# Altium project Omnifly-H7.PrjPcb (part 2 of 2)

## Sheet Pyro-Other.SchDoc: Pyro / Buzzer / CAN
size A4; SheetNumber: 6; SheetTotal: 6
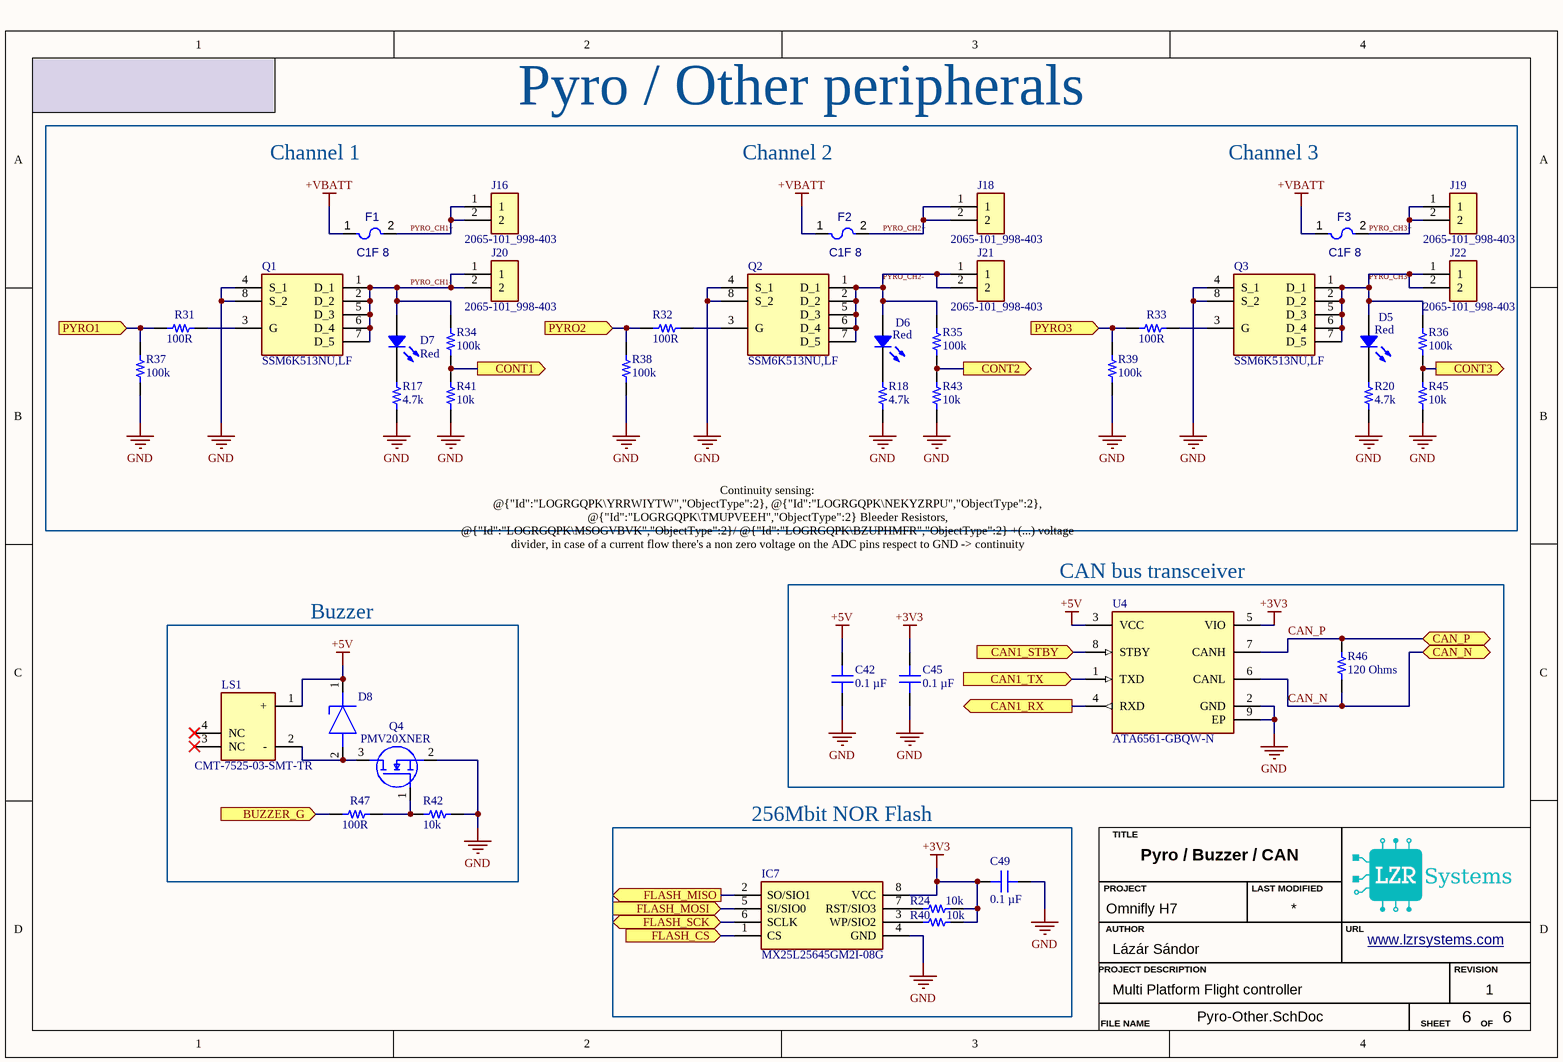
[diagram p4: Pyro-Other.SchDoc]

### Parts
C42  0.1 µF  [MURATA GCM155 0402_1005]
C45  0.1 µF  [MURATA GCM155 0402_1005]
C49  0.1 µF  [MURATA GCM155 0402_1005]
D5  Red  [LED 0402_1005 RED]
D6  Red  [LED 0402_1005 RED]
D7  Red  [LED 0402_1005 RED]
D8  PESD24VS1UA  [SOD2512X110N]  (value not drawn)
F1  C1F 8  [FP-3216FF-IPC_A]
F2  C1F 8  [FP-3216FF-IPC_A]
F3  C1F 8  [FP-3216FF-IPC_A]
IC7  MX25L25645GM2I-08G  [SOIC127P790X216-8N]
J16  2065-101_998-403  [2065101998403]
J18  2065-101_998-403  [2065101998403]
J19  2065-101_998-403  [2065101998403]
J20  2065-101_998-403  [2065101998403]
J21  2065-101_998-403  [2065101998403]
J22  2065-101_998-403  [2065101998403]
LS1  CMT-7525-03-SMT-TR  [CMT752503SMTTR]
Q1  SSM6K513NU,LF  [SSM6K513NULF]
Q2  SSM6K513NU,LF  [SSM6K513NULF]
Q3  SSM6K513NU,LF  [SSM6K513NULF]
Q4  PMV20XNER  [SOT95P230X110-3N]
R17  4.7k  [YAGEO RES 0402_1005]
R18  4.7k  [YAGEO RES 0402_1005]
R20  4.7k  [YAGEO RES 0402_1005]
R24  10k  [YAGEO RES 0402_1005]
R31  100R  [RES 0402_1005]
R32  100R  [RES 0402_1005]
R33  100R  [RES 0402_1005]
R34  100k  [YAGEO RES 0402_1005]
R35  100k  [YAGEO RES 0402_1005]
R36  100k  [YAGEO RES 0402_1005]
R37  100k  [YAGEO RES 0402_1005]
R38  100k  [YAGEO RES 0402_1005]
R39  100k  [YAGEO RES 0402_1005]
R40  10k  [YAGEO RES 0402_1005]
R41  10k  [YAGEO RES 0402_1005]
R42  10k  [YAGEO RES 0402_1005]
R43  10k  [YAGEO RES 0402_1005]
R45  10k  [YAGEO RES 0402_1005]
R46  120 Ohms  [KOA RES RK73 RN73 0603_1608]
R47  100R  [RES 0402_1005]
U4  ATA6561-GBQW-N  [FP-C04-21358-IPC_B]

### Blocks framed on the sheet
CAN bus transceiver: C42 C45 R46 U4
Buzzer: D8 LS1 Q4 R42 R47
256Mbit NOR Flash: C49 IC7 R24 R40

### Ports
BUZZER_G (in), CAN1_RX (out), CAN1_STBY (in), CAN1_TX (in), CAN_N (bidir), CAN_P (bidir), CONT1 (out), CONT2 (out), CONT3 (out), FLASH_CS (in), FLASH_MISO (out), FLASH_MOSI (in), FLASH_SCK (bidir), PYRO1 (in), PYRO2 (in), PYRO3 (in)

### Nets
+3V3: C45.1 C49.1 IC7.8(VCC) R24.1 R40.1 U4.5(VIO)
+5V: C42.1 D8.1(K) LS1.1(+) U4.3(VCC)
+VBATT: F1.1 F2.1 F3.1
GND: C42.2 C45.2 C49.2 IC7.4(GND) Q1.4(S_1) Q1.8(S_2) Q2.4(S_1) Q2.8(S_2) Q3.4(S_1) Q3.8(S_2) Q4.2(S) R17.1 R18.1 R20.1 R37.1 R38.1 R39.1 R41.1 R42.1 R43.1 R45.1 U4.2(GND) U4.9(EP)
AUX_MISO: IC7.2(SO/SIO1) ; port FLASH_MISO
AUX_MOSI: IC7.5(SI/SIO0) ; port FLASH_MOSI
AUX_SCK: IC7.6(SCLK) ; port FLASH_SCK
BUZZER: R47.1 ; port BUZZER_G
CAN_N: R46.1 U4.6(CANL) ; port CAN_N
CAN_P: R46.2 U4.7(CANH) ; port CAN_P
FLASH_CS: IC7.1(CS) ; port FLASH_CS
PYRO_CH1: R31.1 R37.2 ; port PYRO1
PYRO_CH1+: F1.2 J16.1 J16.2
PYRO_CH1-: D7.1 J20.1 J20.2 Q1.1(D_1) Q1.2(D_2) Q1.5(D_3) Q1.6(D_4) Q1.7(D_5) R34.2
PYRO_CH1_CONT: R34.1 R41.2 ; port CONT1
PYRO_CH2: R32.1 R38.2 ; port PYRO2
PYRO_CH2+: F2.2 J18.1 J18.2
PYRO_CH2-: D6.1 J21.1 J21.2 Q2.1(D_1) Q2.2(D_2) Q2.5(D_3) Q2.6(D_4) Q2.7(D_5) R35.2
PYRO_CH2_CONT: R35.1 R43.2 ; port CONT2
PYRO_CH3: R33.1 R39.2 ; port PYRO3
PYRO_CH3+: F3.2 J19.1 J19.2
PYRO_CH3-: D5.1 J22.1 J22.2 Q3.1(D_1) Q3.2(D_2) Q3.5(D_3) Q3.6(D_4) Q3.7(D_5) R36.2
PYRO_CH3_CONT: R36.1 R45.2 ; port CONT3
NetD5_2: D5.2 R20.2
NetD6_2: D6.2 R18.2
NetD7_2: D7.2 R17.2
NetD8_2: D8.2(A) LS1.2(-) Q4.3(D)
NetIC7_3: IC7.3(WP/SIO2) R40.2
NetIC7_7: IC7.7(RST/SIO3) R24.2
NetQ1_3: Q1.3(G) R31.2
NetQ2_3: Q2.3(G) R32.2
NetQ3_3: Q3.3(G) R33.2
NetQ4_1: Q4.1(G) R42.2 R47.2
NetU3_1: U4.8(STBY) ; port CAN1_STBY
NetU3_95: U4.4(RXD) ; port CAN1_RX
NetU3_96: U4.1(TXD) ; port CAN1_TX

Not connected (* = marked no-connect by the designer): LS1 3(NC)* 4(NC)*

### Notes on the sheet
- Pyro / Other peripherals
- Channel 1
- Channel 2
- Channel 3
- Continuity sensing:
  @{"Id":"LOGRGQPK\YRRWIYTW","ObjectType":2}, @{"Id":"LOGRGQPK\NEKYZRPU","ObjectType":2}, @{"Id":"LOGRGQPK\TMUPVEEH","ObjectType":2} Bleeder Resistors, @{"Id":"LOGRGQPK\MSOGVBVK","ObjectType":2}/ @{"Id":"LOGRGQPK\BZUPHMFR","ObjectType":2} +(...) voltage divider, in case of a current flow there's a non zero voltage on the ADC pins respect to GND -> continuity
- TITLE
- AUTHOR
- PROJECT
- LAST MODIFIED
- URL
- PROJECT DESCRIPTION
- REVISION
- FILE NAME
- SHEET
- OF

### Library data of the parts
C42 C45 C49 = GCM155R71H104ME02D: CAP CER 0.1UF 50V X7R 0402; manufacturer: Murata Electronics; Tolerance: ±20%; Part Number: GCM155R71H104ME02D; Capacitance: 0.1 µF; Applications: Automotive; componentlink1description: Datasheet; componentlink1url: https://psearch.en.murata.com/capacitor/product/GCM155R71H104ME02%23.pdf; componentlink2description: DigiKey Link; componentlink2url: https://www.digikey.com/en/products/detail/murata-electronics/GCM155R71H104ME02D/9867913; Device Package: 0402 (1005 Metric); lastupdated: 7/20/2024 2:04:19 AM; Lifecycle Status: Active; Minimum Order: 1; Mounting Type: Surface Mount, MLCC; Operating Temperature: -55°C ~ 125°C; Package / Case: 0402 (1005 Metric); packaging: TapeAndReel; partid: 39038; Part Status: Active; price: 0.01; Ratings: AEC-Q200; series: GCM; Size / Dimension: 0.039" L x 0.020" W (1.00mm x 0.50mm); Supplier 1: DigiKey; Supplier Part Number 1: 490-18204-1-ND; Temperature Coefficient: X7R; Thickness (Max): 0.022" (0.55mm); value: 0.1 µF; Voltage - Rated: 50V
D5-D7 = SM0402RC: LED RED CLEAR 0402 SMD; Manufacturer: Bivar Inc.; Configuration: 0402; Current - Test: 20mA; Lens Color: Colorless; Lens Size: 0.50mm x 1.00mm; Lens Style: Rectangle with Flat Top; Millicandela Rating: 90mcd; Viewing Angle: 130°; Voltage - Forward (Vf) (Typ): 2.1V; Wavelength - Dominant: 631nm; Wavelength - Peak: 645nm; Part Number: SM0402RC; Color: Red; ComponentLink1Description: Datasheet; ComponentLink1URL: https://www.bivar.com/Files/Datasheets/SM0402RC.pdf; ComponentLink2Description: DigiKey Link; ComponentLink2URL: https://www.digikey.com/en/products/detail/bivar-inc/SM0402RC/6810864; Device Package: 0402 (1005 Metric); Height (Max): 0.71mm; LastUpdated: 6/3/2024 7:59:17 PM; Lens Transparency: Clear; Lifecycle Status: Active; Minimum Order: 1; Mounting Type: Surface Mount; Package / Case: 0402 (1005 Metric); Packaging: TapeAndReel; PartId: 509; Part Status: Active; Price: 0.16; Series: -; Size / Dimension: 1.00mm L x 0.50mm W; Supplier 1: DigiKey; Supplier Part Number 1: 492-2208-1-ND; Supplier Device Package: 0402; Value: Red
D8 = PESD24VS1UA,115: Diode ESD (Uni-directional); Manufacturer_Name: Nexperia; Datasheet Link: https://assets.nexperia.com/documents/data-sheet/PESD24VS1UA.pdf; Height: 1.1mm; Manufacturer_Part_Number: PESD24VS1UA,115; Mouser Part Number: 771-PESD24VS1UA115; Mouser Price/Stock: https://www.mouser.co.uk/ProductDetail/Nexperia/PESD24VS1UA115?qs=A1cBxND5mHKZ%252BhkKKiwSEA%3D%3D; Arrow Part Number: PESD24VS1UA,115; Arrow Price/Stock: https://www.arrow.com/en/products/pesd24vs1ua115/nexperia
F1-F3 = CMP-005-00014-1: Fuse Chip Fast Acting 10A 24V SMD Solder Pad 1206 T/R CSA/UL/cULus; Case/Package: 1206; Current Rating: 10A; Pins: 2; Max Operating Temperature: 125°C; Min Operating Temperature: -55°C; Mounting Technology: Surface Mount
IC7 = MX25L25645GM2I-08G: Integrated Circuit; Manufacturer_Name: Macronix; Datasheet Link: https://www.farnell.com/datasheets/2815324.pdf; Height: 2.16mm; Manufacturer_Part_Number: MX25L25645GM2I-08G; Mouser Part Number: N/A; Mouser Price/Stock: https://www.mouser.co.uk/ProductDetail/Macronix/MX25L25645GM2I-08G?qs=Z%252BL2brAPG1Ifpgm4Amotqg%3D%3D; Arrow Part Number: MX25L25645GM2I-08G; Arrow Price/Stock: https://www.arrow.com/en/products/mx25l25645gm2i-08g/macronix-international?utm_currency=USD&region=nac
J16 J18-J22 = 2065-101_998-403: Connector; Manufacturer_Name: Wago; Manufacturer_Part_Number: 2065-101/998-403; Datasheet Link: https://www.farnell.com/datasheets/2849884.pdf?_gl=1*d6n7fb*_gcl_au*MTg5NzcyMzM3OS4xNzU0MjQ4OTUy; Height: 2.7mm
LS1 = CMT-7525-03-SMT-TR: Loudspeaker or Buzzer; Manufacturer_Name: Same Sky; Description: CMT-7525-03-SMT-TR - 7.5 mm; Datasheet Link: https://www.sameskydevices.com/product/resource/CMT-7525-03-SMT-TR.pdf; Height: 2.7mm; Manufacturer_Part_Number: CMT-7525-03-SMT-TR; Mouser Part Number: 179-CMT-7525-03SMTTR; Mouser Price/Stock: https://www.mouser.co.uk/ProductDetail/Same-Sky/CMT-7525-03-SMT-TR?qs=olJun0bQHM86ULzT6E8ouQ%3D%3D
Q1-Q3 = SSM6K513NU,LF: MOSFET (N-Channel); Manufacturer_Name: Toshiba; Datasheet Link: https://toshiba.semicon-storage.com/info/docget.jsp?did=53148&prodName=SSM6K513NU; Height: 0.8mm; Manufacturer_Part_Number: SSM6K513NU,LF; Mouser Part Number: 757-SSM6K513NULF; Mouser Price/Stock: https://www.mouser.co.uk/ProductDetail/Toshiba/SSM6K513NULF?qs=zPgndZZmKGbOGaIT7oO3Dw%3D%3D; Arrow Part Number: SSM6K513NU,LF; Arrow Price/Stock: https://www.arrow.com/en/products/ssm6k513nulf/toshiba?region=nac
Q4 = PMV20XNER: MOSFET (N-Channel); Manufacturer_Name: Nexperia; Datasheet Link: https://assets.nexperia.com/documents/data-sheet/PMV20XNE.pdf; Height: 1.1mm; Manufacturer_Part_Number: PMV20XNER; Mouser Part Number: 771-PMV20XNER; Mouser Price/Stock: https://www.mouser.co.uk/ProductDetail/Nexperia/PMV20XNER?qs=%252BRKXB2WKlSevPnXiP0DAaQ%3D%3D; Arrow Part Number: PMV20XNER; Arrow Price/Stock: https://www.arrow.com/en/products/pmv20xner/nexperia?utm_currency=USD&region=nac
R17 R18 R20 = AC0402FR-7W4K7L: RES 4.7K OHM 1% 1/8W 0402; Manufacturer: Yageo; Power (Watts): 0.125W, 1/8W; Resistance: 4.7 kOhms; Temperature Coefficient: ±100ppm/°C; Part Number: AC0402FR-7W4K7L; Value: 4.7k; ComponentLink1Description: Datasheet; ComponentLink1URL: https://www.yageo.com/upload/media/product/productsearch/datasheet/rchip/PYu-AC_51_RoHS_L_10.pdf; ComponentLink2Description: DigiKey Link; ComponentLink2URL: https://www.digikey.com/en/products/detail/yageo/AC0402FR-7W4K7L/17009027; Composition: Thick Film; Device Package: 0402 (1005 Metric); Features: Automotive AEC-Q200, Moisture Resistant; Height - Seated (Max): 0.015" (0.37mm); LastUpdated: 8/31/2025 3:03:39 PM; Lifecycle Status: Active; Minimum Order: 1; Number of Terminations: 2; Operating Temperature: -55°C ~ 155°C; Package / Case: 0402 (1005 Metric); Packaging: CutTape; PartId: 78681; Price: 0.01; Ratings: AEC-Q200; Series: AC; Size / Dimension: 0.039" L x 0.020" W (1.00mm x 0.50mm); Supplier 1: DigiKey; Supplier Part Number 1: 13-AC0402FR-7W4K7LCT-ND; Supplier Device Package: 0402; Tolerance: ±1%
R24 R40-R43 R45 = AC0402FR-1310KL: RES 10K OHM 1% 1/16W 0402; Manufacturer: Yageo; Power (Watts): 0.063W, 1/16W; Resistance: 10 kOhms; Temperature Coefficient: ±100ppm/°C; Part Number: AC0402FR-1310KL; Value: 10k; ComponentLink1Description: Datasheet; ComponentLink1URL: https://www.yageo.com/upload/media/product/productsearch/datasheet/rchip/PYu-AC_51_RoHS_L_8.pdf; ComponentLink2Description: DigiKey Link; ComponentLink2URL: https://www.digikey.com/en/products/detail/yageo/AC0402FR-1310KL/12756397; Composition: Thick Film; Device Package: 0402 (1005 Metric); Features: Automotive AEC-Q200, Moisture Resistant; Height - Seated (Max): 0.015" (0.37mm); LastUpdated: 8/31/2025 3:03:46 PM; Lifecycle Status: Active; Minimum Order: 1; Number of Terminations: 2; Operating Temperature: -55°C ~ 155°C; Package / Case: 0402 (1005 Metric); Packaging: CutTape; PartId: 69220; Part Status: Active; Price: 0.01; Ratings: AEC-Q200; Series: AC; Size / Dimension: 0.039" L x 0.020" W (1.00mm x 0.50mm); Supplier 1: DigiKey; Supplier Part Number 1: 13-AC0402FR-1310KLCT-ND; Supplier Device Package: 0402; Tolerance: ±1%
R31-R33 R47 = 504L1000FTNCFT: RES SMD 100 OHM 1% 1/8W 0402; Manufacturer: American Technical Ceramics; Power (Watts): 0.125W, 1/8W; Resistance: 100 Ohms; Temperature Coefficient: -50/ -150ppm/°C; Part Number: 504L1000FTNCFT; Value: 100R; ComponentLink1Description: Datasheet; ComponentLink1URL: http://www.atceramics.com/UserFiles/504L_ubr_resistor.pdf; ComponentLink2Description: DigiKey Link; ComponentLink2URL: http://digikey.com/product-detail/en/american-technical-ceramics/504L1000FTNCFT/1284-1327-1-ND/4789907; Composition: Thin Film; Device Package: 0402 (1005 Metric); Features: RF, High Frequency; Height - Seated (Max): 0.024" (0.60mm); LastUpdated: 2/9/2024 8:30:03 PM; Lifecycle Status: Active; Minimum Order: 1; Number of Terminations: 2; Operating Temperature: -40°C ~ 125°C; Package / Case: 0402 (1005 Metric); Packaging: TapeAndReel; PartId: 7485; Part Status: Active; Price: 1.53; Series: ATC504; Size / Dimension: 0.039" L x 0.020" W (1.00mm x 0.50mm); Supplier 1: DigiKey; Supplier Part Number 1: 1284-1327-1-ND; Supplier Device Package: 0402; Tolerance: ±1%
R34-R39 = AC0402FR-13100KL: RES 100K OHM 1% 1/16W 0402; Manufacturer: Yageo; Power (Watts): 0.063W, 1/16W; Resistance: 100 kOhms; Temperature Coefficient: ±100ppm/°C; Part Number: AC0402FR-13100KL; Value: 100k; ComponentLink1Description: Datasheet; ComponentLink1URL: https://www.yageo.com/upload/media/product/productsearch/datasheet/rchip/PYu-AC_51_RoHS_L_8.pdf; ComponentLink2Description: DigiKey Link; ComponentLink2URL: https://www.digikey.com/en/products/detail/yageo/AC0402FR-13100KL/14008459; Composition: Thick Film; Device Package: 0402 (1005 Metric); Features: Automotive AEC-Q200; Height - Seated (Max): 0.015" (0.37mm); LastUpdated: 8/31/2025 3:03:52 PM; Lifecycle Status: Active; Minimum Order: 1; Number of Terminations: 2; Operating Temperature: -55°C ~ 155°C; Package / Case: 0402 (1005 Metric); Packaging: CutTape; PartId: 65177; Part Status: Active; Price: 0.01; Ratings: AEC-Q200; Series: AC; Size / Dimension: 0.039" L x 0.020" W (1.00mm x 0.50mm); Supplier 1: DigiKey; Supplier Part Number 1: 13-AC0402FR-13100KLCT-ND; Supplier Device Package: 0402; Tolerance: ±1%
R46 = RK73H1JTTD1200F: RES 120 OHM 1% 1/8W 0603; Manufacturer: KOA Speer Electronics, Inc.; Power (Watts): 0.125W, 1/8W; Temperature Coefficient: ±100ppm/°C; Part Number: RK73H1JTTD1200F; Value: 120 Ohms; ComponentLink1Description: Datasheet; ComponentLink1URL: http://www.koaspeer.com/catimages/Products/RK73H/RK73H.pdf; ComponentLink2Description: DigiKey Link; ComponentLink2URL: https://www.digikey.com/en/products/detail/koa-speer-electronics-inc/RK73H1JTTD1200F/9844960; Composition: Thick Film; Device Package: 0603 (1608 Metric); Features: Automotive AEC-Q200; Height - Seated (Max): 0.022" (0.55mm); LastUpdated: 7/25/2024 9:43:06 AM; Lifecycle Status: Active; Minimum Order: 1; Number of Terminations: 2; Operating Temperature: -55°C ~ 155°C; Package / Case: 0603 (1608 Metric); Packaging: CutTape; PartId: 15761; Part Status: Active; Price: 0.01; Ratings: AEC-Q200; Resistance: 120 Ohms; Series: RK73H; Size / Dimension: 0.063" L x 0.031" W (1.60mm x 0.80mm); Supplier 1: DigiKey; Supplier Part Number 1: 2019-RK73H1JTTD1200FCT-ND; Supplier Device Package: 0603; Tolerance: ±1%
U4 = CMP-015-00008-1: Industrial Grade Can Trx With Vio Pin (Dfn8) Rohs Compliant: Yes; Min Supply Voltage: 4.5V; Max Supply Voltage: 5.5V; Min Operating Temperature: -40°C; Pins: 8; Max Operating Temperature: 150°C

## Sheet Power-scheme.SchDoc: Power Scheme
size A4; Author: Lázár Sándor; SheetNumber: 2; SheetTotal: 6; URL: lzrsystems.com
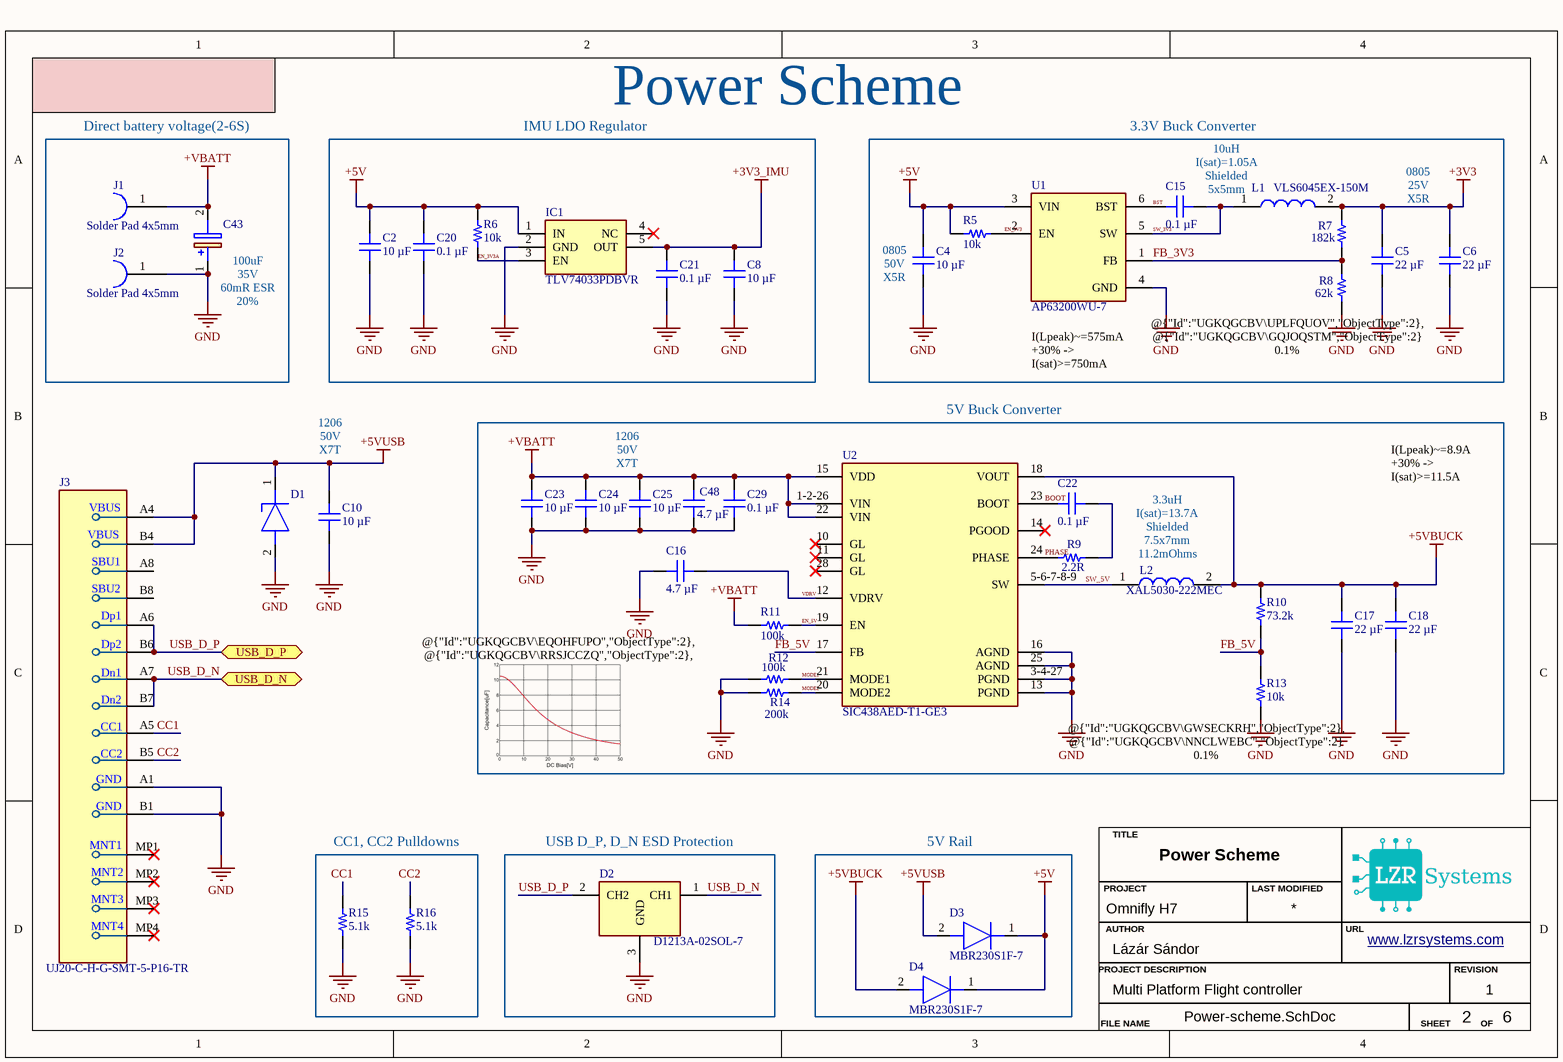
[diagram p5: Power-scheme.SchDoc]

### Parts
C2  10 µF  [MURATA GRM21B 0805_2012]
C4  10 µF  [MURATA GRM21B 0805_2012]
C5  22 µF  [MURATA GRM21B 0805_2012]
C6  22 µF  [MURATA GRM21B 0805_2012]
C8  10 µF  [MURATA GRM21B 0805_2012]
C10  10 µF  [MURATA GRM21B 0805_2012]
C15  0.1 µF  [MURATA GCM155 0402_1005]
C16  4.7 µF  [MURATA GRM21B 0805_2012]
C17  22 µF  [CAP 1206_3216 - 0.8MM]
C18  22 µF  [CAP 1206_3216 - 0.8MM]
C20  0.1 µF  [MURATA GCM155 0402_1005]
C21  0.1 µF  [MURATA GCM155 0402_1005]
C22  0.1 µF  [MURATA GCM155 0402_1005]
C23  10 µF  [CAP 1206_3216 - 0.8MM]
C24  10 µF  [CAP 1206_3216 - 0.8MM]
C25  10 µF  [CAP 1206_3216 - 0.8MM]
C29  0.1 µF  [MURATA GCM155 0402_1005]
C43  T523H107M035APE070  [CAPPM7360X200N]  (value not drawn)
C48  4.7 µF  [MURATA GRM21B 0805_2012]
D1  PESD24VS1UA  [SOD2512X110N]  (value not drawn)
D2  D1213A-02SOL-7  [D1213A02SOL7]
D3  MBR230S1F-7  [SODFL3518X115N]
D4  MBR230S1F-7  [SODFL3518X115N]
IC1  TLV74033PDBVR  [SOT95P280X145-5N]
J1  Solder Pad 4x5mm  [Solder Pad 4x5mm-Footprint-1]
J2  Solder Pad 4x5mm  [Solder Pad 4x5mm-Footprint-1]
J3  UJ20-C-H-G-SMT-5-P16-TR  [UJ20CHGSMT5P16TR]
L1  VLS6045EX-150M  [VLS6045]
L2  XAL5030-222MEC  [XAL5030222MEC]
R5  10k  [YAGEO RES 0402_1005]
R6  10k  [YAGEO RES 0402_1005]
R7  182k  [YAGEO RES 0402_1005]
R8  62k  [YAGEO RES 0402_1005]
R9  2.2R  [YAGEO RES 0402_1005]
R10  73.2k  [YAGEO RES 0402_1005]
R11  100k  [YAGEO RES 0402_1005]
R12  100k  [YAGEO RES 0402_1005]
R13  10k  [YAGEO RES 0402_1005]
R14  200k  [YAGEO RES 0402_1005]
R15  5.1k  [YAGEO RES 0402_1005]
R16  5.1k  [YAGEO RES 0402_1005]
U1  AP63200WU-7  [FP-TSOT26-MFG]
U2  SIC438AED-T1-GE3  [FP-T22-0442-MFG]

### Blocks framed on the sheet
Direct battery voltage(2-6S): C43 J1 J2
IMU LDO Regulator: C2 C8 C20 C21 IC1 R6
3.3V Buck Converter: C4-C6 C15 L1 R5 R7 R8 U1
5V Buck Converter: C16-C18 C22-C25 C29 C48 L2 R9-R14 U2
CC1, CC2 Pulldowns: R15 R16
USB D_P, D_N ESD Protection: D2
5V Rail: D3 D4

### Ports
USB_D_N (bidir), USB_D_P (bidir)

### Nets
+3V3: C5.2 C6.2 L1.2 R7.2
+3V3_IMU: C8.2 C21.2 IC1.5(OUT)
+5V: C2.2 C4.2 C20.2 D3.1(K) D4.1(K) IC1.1(IN) R5.2 R6.2 U1.3(VIN)
+5VBUCK: C17.2 C18.2 D4.2(A) L2.2 R10.2 U2.18(VOUT)
+5VUSB: C10.2 D1.1(K) D3.2(A) J3.A4(VBUS) J3.B4(VBUS_2)
+VBATT: C23.2 C24.2 C25.2 C29.2 C43.2(-) C48.2 J1.1 R11.1 U2.1-2-26(VIN) U2.15(VDD) U2.22(VIN)
GND: C2.1 C4.1 C5.1 C6.1 C8.1 C10.1 C16.1 C17.1 C18.1 C20.1 C21.1 C23.1 C24.1 C25.1 C29.1 C43.1(+) C48.1 D1.2(A) D2.3(GND) IC1.2(GND) J2.1 J3.A1(GND_1) J3.B1(GND_2) R8.2 R12.1 R13.2 R14.1 R15.1 R16.1 U1.4(GND) U2.3-4-27(PGND) U2.13(PGND) U2.16(AGND) U2.25(AGND)
BOOT: C22.2 U2.23(BOOT)
BST: C15.2 U1.6(BST)
CC1: J3.A5(CC1) R15.2
CC2: J3.B5(CC2) R16.2
EN_3V3: R5.1 U1.2(EN)
EN_3V3A: IC1.3(EN) R6.1
EN_5V: R11.2 U2.19(EN)
FB_3V3: R7.1 R8.1 U1.1(FB)
FB_5V: R10.1 R13.1 U2.17(FB)
MODE1: R12.2 U2.21(MODE1)
MODE2: R14.2 U2.20(MODE2)
PHASE: R9.1 U2.24(PHASE)
SW_3V3: C15.1 L1.1 U1.5(SW)
SW_5V: L2.1 U2.5-6-7-8-9(SW)
USB_D_N: D2.1(CH1) J3.A7(DN1) J3.B7(DN2) ; port USB_D_N
USB_D_P: D2.2(CH2) J3.A6(DP1) J3.B6(DP2) ; port USB_D_P
VDRV: C16.2 U2.12(VDRV)
NetC22_1: C22.1 R9.2

Not connected (* = marked no-connect by the designer): IC1 4(NC)*; J3 A8(SBU1) B8(SBU2) MP1* MP2* MP3* MP4*; U2 10(GL)* 11(GL)* 14(PGOOD)* 28(GL)*

### Notes on the sheet
- Power Scheme
- 10uH
  I(sat)=1.05A
  Shielded 5x5mm
- 0805
  25V
  X5R
- (near C43) 100uF
  35V
  60mR ESR
  20%
- (near C4) 0805
  50V
  X5R
- (near U1) I(Lpeak)~=575mA +30% ->
  I(sat)>=750mA
- (near R8) @{"Id":"UGKQGCBV\UPLFQUOV","ObjectType":2}, @{"Id":"UGKQGCBV\GQJOQSTM","ObjectType":2}
  0.1%
  25ppm
- 1206
  50V
  X7T
- I(Lpeak)~=8.9A +30% ->
  I(sat)>=11.5A
- (near L2) 3.3uH
  I(sat)=13.7A
  Shielded 7.5x7mm
  11.2mOhms
- @{"Id":"UGKQGCBV\EQOHFUPO","ObjectType":2}, @{"Id":"UGKQGCBV\RRSJCCZQ","ObjectType":2}, @{"Id":"UGKQGCBV\IXDVLWBT","ObjectType":2}
  DC Bias Characteristics
- (near R13) @{"Id":"UGKQGCBV\GWSECKRH","ObjectType":2}, @{"Id":"UGKQGCBV\NNCLWEBC","ObjectType":2}
  0.1%
  25ppm
- TITLE
- AUTHOR
- PROJECT
- LAST MODIFIED
- URL
- PROJECT DESCRIPTION
- REVISION
- FILE NAME
- SHEET
- OF
- (in symbol UJ20-C-H-G-SMT-5-P16-TR) Dp1; Dp2; Dn1; Dn2; GND; MNT1; MNT2; MNT3; MNT4

### Library data of the parts
C2 C4 C8 C10 = GRM21BR61H106ME43L: CAP CER 10UF 50V X5R 0805; manufacturer: Murata Electronics; Tolerance: ±20%; Part Number: GRM21BR61H106ME43L; Capacitance: 10 µF; Applications: General Purpose; componentlink1description: Datasheet; componentlink1url: https://search.murata.co.jp/Ceramy/image/img/A01X/G101/ENG/GRM21BR61H106ME43-01A.pdf; componentlink2description: DigiKey Link; componentlink2url: https://www.digikey.com/en/products/detail/murata-electronics/GRM21BR61H106ME43L/10326317; Device Package: 0805 (2012 Metric); lastupdated: 8/27/2024 9:29:56 AM; Lifecycle Status: Active; Minimum Order: 1; Mounting Type: Surface Mount, MLCC; Operating Temperature: -55°C ~ 85°C; Package / Case: 0805 (2012 Metric); packaging: TapeAndReel; partid: 41295; Part Status: Active; price: 0.05; series: GRM; Size / Dimension: 0.079" L x 0.049" W (2.00mm x 1.25mm); Supplier 1: DigiKey; Supplier Part Number 1: 490-18664-1-ND; Temperature Coefficient: X5R; Thickness (Max): 0.057" (1.45mm); value: 10 µF; Voltage - Rated: 50V
C5 C6 = GRM21BR61C226ME44L: CAP CER 22UF 16V X5R 0805; manufacturer: Murata Electronics; Tolerance: ±20%; Part Number: GRM21BR61C226ME44L; Capacitance: 22 µF; Applications: General Purpose; componentlink1description: Datasheet; componentlink1url: https://search.murata.co.jp/Ceramy/image/img/A01X/G101/ENG/GRM21BR61C226ME44-01.pdf; componentlink2description: DigiKey Link; componentlink2url: https://www.digikey.com/en/products/detail/murata-electronics/GRM21BR61C226ME44L/4905531; Device Package: 0805 (2012 Metric); lastupdated: 8/27/2024 9:29:55 AM; Lifecycle Status: Active; Minimum Order: 1; Mounting Type: Surface Mount, MLCC; Operating Temperature: -55°C ~ 85°C; Package / Case: 0805 (2012 Metric); packaging: TapeAndReel; partid: 16967; Part Status: Active; price: 0.06; series: GRM; Size / Dimension: 0.079" L x 0.049" W (2.00mm x 1.25mm); Supplier 1: DigiKey; Supplier Part Number 1: 490-10747-1-ND; Temperature Coefficient: X5R; Thickness (Max): 0.057" (1.45mm); value: 22 µF; Voltage - Rated: 16V
C15 C20-C22 C29 = GCM155R71H104ME02D: as C42 on sheet Pyro-Other; Part Number: GCM155R71H104ME02D; Capacitance: 0.1 µF; Applications: Automotive; componentlink1description: Datasheet; componentlink1url: https://psearch.en.murata.com/capacitor/product/GCM155R71H104ME02%23.pdf; componentlink2description: DigiKey Link; componentlink2url: https://www.digikey.com/en/products/detail/murata-electronics/GCM155R71H104ME02D/9867913; Device Package: 0402 (1005 Metric); lastupdated: 7/20/2024 2:04:19 AM; Lifecycle Status: Active; Minimum Order: 1; Mounting Type: Surface Mount, MLCC; Operating Temperature: -55°C ~ 125°C; Package / Case: 0402 (1005 Metric); packaging: TapeAndReel; partid: 39038; Part Status: Active; price: 0.01; Ratings: AEC-Q200; series: GCM; Size / Dimension: 0.039" L x 0.020" W (1.00mm x 0.50mm); Supplier 1: DigiKey; Supplier Part Number 1: 490-18204-1-ND; Temperature Coefficient: X7R; Thickness (Max): 0.022" (0.55mm); value: 0.1 µF; Voltage - Rated: 50V
C16 C48 = GRM21BR61H475KE51L: CAP CER 4.7UF 50V X5R 0805; manufacturer: Murata Electronics; Tolerance: ±10%; Part Number: GRM21BR61H475KE51L; Capacitance: 4.7 µF; Applications: General Purpose; componentlink1description: Datasheet; componentlink1url: https://search.murata.co.jp/Ceramy/image/img/A01X/G101/ENG/GRM21BR61H475KE51-01.pdf; componentlink2description: DigiKey Link; componentlink2url: https://www.digikey.com/en/products/detail/murata-electronics/GRM21BR61H475KE51L/4905540; Device Package: 0805 (2012 Metric); lastupdated: 8/27/2024 9:29:55 AM; Lifecycle Status: Active; Minimum Order: 1; Mounting Type: Surface Mount, MLCC; Operating Temperature: -55°C ~ 85°C; Package / Case: 0805 (2012 Metric); packaging: TapeAndReel; partid: 15077; Part Status: Active; price: 0.03; series: GRM; Size / Dimension: 0.079" L x 0.049" W (2.00mm x 1.25mm); Supplier 1: DigiKey; Supplier Part Number 1: 490-10751-1-ND; Temperature Coefficient: X5R; Thickness (Max): 0.055" (1.40mm); value: 4.7 µF; Voltage - Rated: 50V
C17 C18 = GRT31CC81C226ME01L: CAP CER 22UF 16V X6S 1206; manufacturer: Murata Electronics; Tolerance: ±20%; Part Number: GRT31CC81C226ME01L; Capacitance: 22 µF; Applications: Automotive; componentlink1description: Datasheet; componentlink1url: https://search.murata.co.jp/Ceramy/image/img/A01X/G101/ENG/GRT31CC81C226ME01-01.pdf; componentlink2description: DigiKey Link; componentlink2url: https://www.digikey.com/en/products/detail/murata-electronics/GRT31CC81C226ME01L/5416832; Device Package: 1206 (3216 Metric); lastupdated: 6/4/2024 7:10:39 PM; Lifecycle Status: Active; Minimum Order: 1; Mounting Type: Surface Mount, MLCC; Operating Temperature: -55°C ~ 105°C; Package / Case: 1206 (3216 Metric); packaging: TapeAndReel; partid: 20406; Part Status: Active; price: 0.09; Ratings: AEC-Q200; series: GRT; Size / Dimension: 0.126" L x 0.063" W (3.20mm x 1.60mm); Supplier 1: DigiKey; Supplier Part Number 1: 490-12410-1-ND; Temperature Coefficient: X6S; Thickness (Max): 0.071" (1.80mm); value: 22 µF; Voltage - Rated: 16V
C23-C25 = CGA5L3X5R1H106K160AB: CAP CER 10UF 50V X5R 1206; manufacturer: TDK Corporation; Tolerance: ±10%; Part Number: CGA5L3X5R1H106K160AB; Capacitance: 10 µF; Applications: Automotive; componentlink1description: Datasheet; componentlink1url: https://product.tdk.com/info/en/catalog/datasheets/mlcc_automotive_general_en.pdf?ref_disty=digikey; componentlink2description: DigiKey Link; componentlink2url: https://www.digikey.com/en/products/detail/tdk-corporation/CGA5L3X5R1H106K160AB/2781312; Device Package: 1206 (3216 Metric); lastupdated: 6/4/2024 7:10:33 PM; Lifecycle Status: Active; Minimum Order: 1; Mounting Type: Surface Mount, MLCC; Operating Temperature: -55°C ~ 85°C; Package / Case: 1206 (3216 Metric); packaging: TapeAndReel; partid: 54402; Part Status: Active; price: 0.22; Ratings: AEC-Q200; series: CGA; Size / Dimension: 0.126" L x 0.063" W (3.20mm x 1.60mm); Supplier 1: DigiKey; Supplier Part Number 1: 445-7886-1-ND; Temperature Coefficient: X5R; Thickness (Max): 0.075" (1.90mm); value: 10 µF; Voltage - Rated: 50V
C43 = T523H107M035APE070: Capacitor Polarised; Manufacturer_Name: KEMET; Datasheet Link: https://content.kemet.com/datasheets/KEM_T2079_SSD.pdf; Height: 2mm; Manufacturer_Part_Number: T523H107M035APE070; Mouser Part Number: 80-T523H107M35APE070; Mouser Price/Stock: https://www.mouser.co.uk/ProductDetail/KEMET/T523H107M035APE070?qs=unwgFEO1A6s1KPLWumNkZA%3D%3D; Arrow Part Number: T523H107M035APE070; Arrow Price/Stock: https://www.arrow.com/en/products/t523h107m035ape070/kemet-corporation
D1 = PESD24VS1UA,115: as D8 on sheet Pyro-Other; Datasheet Link: https://assets.nexperia.com/documents/data-sheet/PESD24VS1UA.pdf; Height: 1.1mm; Manufacturer_Part_Number: PESD24VS1UA,115; Mouser Part Number: 771-PESD24VS1UA115; Mouser Price/Stock: https://www.mouser.co.uk/ProductDetail/Nexperia/PESD24VS1UA115?qs=A1cBxND5mHKZ%252BhkKKiwSEA%3D%3D; Arrow Part Number: PESD24VS1UA,115; Arrow Price/Stock: https://www.arrow.com/en/products/pesd24vs1ua115/nexperia
D2 = D1213A-02SOL-7: TVS Diode (Uni-directional); Manufacturer_Name: Diodes Incorporated; Datasheet Link: https://www.diodes.com//assets/Datasheets/D1213A-02SOL.pdf; Height: 1.2mm; Manufacturer_Part_Number: D1213A-02SOL-7; Mouser Part Number: 621-D1213A-02SOL-7; Mouser Price/Stock: https://www.mouser.co.uk/ProductDetail/Diodes-Incorporated/D1213A-02SOL-7?qs=gfe7vQ8txpUT2qMa05IpnA%3D%3D; Arrow Part Number: D1213A-02SOL-7; Arrow Price/Stock: https://www.arrow.com/en/products/d1213a-02sol-7/diodes-incorporated?utm_currency=USD&region=nac
D3 D4 = MBR230S1F-7: Diode; Manufacturer_Name: Diodes Incorporated; Datasheet Link: https://www.diodes.com/assets/Datasheets/MBR230S1F.pdf; Height: 1.15mm; Manufacturer_Part_Number: MBR230S1F-7; Mouser Part Number: 621-MBR230S1F-7; Mouser Price/Stock: https://www.mouser.co.uk/ProductDetail/Diodes-Incorporated/MBR230S1F-7?qs=5V6w%252Be2aIqaf4rGxjeeHeQ%3D%3D; Arrow Part Number: MBR230S1F-7; Arrow Price/Stock: https://www.arrow.com/en/products/mbr230s1f-7/diodes-incorporated?region=nac
IC1 = TLV74033PDBVR: Integrated Circuit; Manufacturer_Name: Texas Instruments; Datasheet Link: https://www.ti.com/lit/ds/symlink/tlv740p.pdf?ts=1599647884466&ref_url=https%253A%252F%252Fwww.ti.com%252Fpower-management%252Flinear-regulators-ldo%252Fproducts.html; Height: 1.45mm; Manufacturer_Part_Number: TLV74033PDBVR; Mouser Part Number: 595-TLV74033PDBVR; Mouser Price/Stock: https://www.mouser.co.uk/ProductDetail/Texas-Instruments/TLV74033PDBVR?qs=sPbYRqrBIVkaG2WMvPh1eg%3D%3D; Arrow Part Number: TLV74033PDBVR; Arrow Price/Stock: https://www.arrow.com/en/products/tlv74033pdbvr/texas-instruments?utm_currency=USD&region=nac
J1 J2 = CMP-002-00080-1: Solerd Pad 4x5mm mainly for Flight Controller Vbatt
J3 = UJ20-C-H-G-SMT-5-P16-TR: Connector; Manufacturer_Name: Same Sky; Datasheet Link: https://www.sameskydevices.com/product/resource/UJ20-C-H-G-SMT-5-P16-TR.pdf; Height: 3.41mm; Manufacturer_Part_Number: UJ20-C-H-G-SMT-5-P16-TR; Mouser Part Number: 179-UJ20CHGSMT5P16TR; Mouser Price/Stock: https://www.mouser.co.uk/ProductDetail/Same-Sky/UJ20-C-H-G-SMT-5-P16-TR?qs=IKkN%2F947nfD2hE8asV9%252BEg%3D%3D; Arrow Part Number: UJ20-C-H-G-SMT-5-P16-TR; Arrow Price/Stock: https://www.arrow.com/en/products/uj20-c-h-g-smt-5-p16-tr/cui-devices?utm_currency=USD&region=nac
L1 = VLS6045EX-150M: Inductor; Manufacturer_Name: TDK; Datasheet Link: https://product.tdk.com/system/files/dam/doc/product/inductor/inductor/smd/catalog/inductor_commercial_power_vls6045ex_en.pdf; Manufacturer_Part_Number: VLS6045EX-150M; Mouser Part Number: 810-VLS6045EX-150M; Mouser Price/Stock: https://www.mouser.co.uk/ProductDetail/TDK/VLS6045EX-150M?qs=oF%2FSscNnLpDh4m%2FVdQ%2FgKQ%3D%3D; Arrow Part Number: VLS6045EX-150M; Arrow Price/Stock: https://www.arrow.com/en/products/vls6045ex-150m/tdk?region=nac
L2 = XAL5030-222MEC: Inductor; Manufacturer_Name: COILCRAFT; Datasheet Link: https://www.coilcraft.com/getmedia/49bc46c8-4b2c-45b9-9b6c-2eaa235ea698/xal50xx.pdf; Height: 3.1mm; Manufacturer_Part_Number: XAL5030-222MEC; Mouser Part Number: 994-XAL5030-222MEC; Mouser Price/Stock: https://www.mouser.co.uk/ProductDetail/Coilcraft/XAL5030-222MEC?qs=zCSbvcPd3pamMZlPWCpd5A%3D%3D
R5 R6 R13 = AC0402DR-0710KL: RES 10K OHM 0.5% 1/16W 0402; Manufacturer: Yageo; Power (Watts): 0.063W, 1/16W; Resistance: 10 kOhms; Temperature Coefficient: ±100ppm/°C; Part Number: AC0402DR-0710KL; Value: 10k; ComponentLink1Description: Datasheet; ComponentLink1URL: https://www.yageo.com/upload/media/product/productsearch/datasheet/rchip/PYu-AC_51_RoHS_L_9.pdf; ComponentLink2Description: DigiKey Link; ComponentLink2URL: https://www.digikey.com/en/products/detail/yageo/AC0402DR-0710KL/16990352; Composition: Thick Film; Device Package: 0402 (1005 Metric); Features: Automotive AEC-Q200, Moisture Resistant; Height - Seated (Max): 0.015" (0.37mm); LastUpdated: 8/31/2025 3:03:41 PM; Lifecycle Status: Active; Minimum Order: 1; Number of Terminations: 2; Operating Temperature: -55°C ~ 155°C; Package / Case: 0402 (1005 Metric); Packaging: TapeAndReel; PartId: 77661; Part Status: Active; Price: 0.01; Ratings: AEC-Q200; Series: AC; Size / Dimension: 0.039" L x 0.020" W (1.00mm x 0.50mm); Supplier 1: DigiKey; Supplier Part Number 1: 13-AC0402DR-0710KLCT-ND; Supplier Device Package: 0402; Tolerance: ±0.5%
R7 = AC0402FR-07182KL: RES SMD 182K OHM 1% 1/16W 0402; Manufacturer: Yageo; Power (Watts): 0.063W, 1/16W; Resistance: 182 kOhms; Temperature Coefficient: ±100ppm/°C; Part Number: AC0402FR-07182KL; Value: 182k; ComponentLink1Description: Datasheet; ComponentLink1URL: https://www.yageo.com/upload/media/product/productsearch/datasheet/rchip/PYu-AC_51_RoHS_L_10.pdf; ComponentLink2Description: DigiKey Link; ComponentLink2URL: https://www.digikey.com/en/products/detail/yageo/AC0402FR-07182KL/5895110; Composition: Thick Film; Device Package: 0402 (1005 Metric); Features: Automotive AEC-Q200, Moisture Resistant; Height - Seated (Max): 0.015" (0.37mm); LastUpdated: 8/31/2025 3:03:39 PM; Lifecycle Status: Active; Minimum Order: 1; Number of Terminations: 2; Operating Temperature: -55°C ~ 155°C; Package / Case: 0402 (1005 Metric); Packaging: CutTape; PartId: 79430; Price: 0.01; Ratings: AEC-Q200; Series: AC; Size / Dimension: 0.039" L x 0.020" W (1.00mm x 0.50mm); Supplier 1: DigiKey; Supplier Part Number 1: 13-AC0402FR-07182KLCT-ND; Supplier Device Package: 0402; Tolerance: ±1%
R8 = AC0402FR-0762KL: RES SMD 62K OHM 1% 1/16W 0402; Manufacturer: Yageo; Power (Watts): 0.063W, 1/16W; Resistance: 62 kOhms; Temperature Coefficient: ±100ppm/°C; Part Number: AC0402FR-0762KL; Value: 62k; ComponentLink1Description: Datasheet; ComponentLink1URL: https://www.yageo.com/upload/media/product/productsearch/datasheet/rchip/PYu-AC_51_RoHS_L_8.pdf; ComponentLink2Description: DigiKey Link; ComponentLink2URL: https://www.digikey.com/en/products/detail/yageo/AC0402FR-0762KL/5895460; Composition: Thick Film; Device Package: 0402 (1005 Metric); Features: Automotive AEC-Q200, Moisture Resistant; Height - Seated (Max): 0.015" (0.37mm); LastUpdated: 8/31/2025 3:03:55 PM; Lifecycle Status: Active; Minimum Order: 1; Number of Terminations: 2; Operating Temperature: -55°C ~ 155°C; Package / Case: 0402 (1005 Metric); Packaging: CutTape; PartId: 60448; Part Status: Active; Price: 0.01; Ratings: AEC-Q200; Series: AC; Size / Dimension: 0.039" L x 0.020" W (1.00mm x 0.50mm); Supplier 1: DigiKey; Supplier Part Number 1: 13-AC0402FR-0762KLCT-ND; Supplier Device Package: 0402; Tolerance: ±1%
R9 = AC0402FR-072R2L: RES SMD 2.2 OHM 1% 1/16W 0402; Manufacturer: Yageo; Power (Watts): 0.063W, 1/16W; Resistance: 2.2 Ohms; Temperature Coefficient: ±200ppm/°C; Part Number: AC0402FR-072R2L; Value: 2.2R; ComponentLink1Description: Datasheet; ComponentLink1URL: https://www.yageo.com/upload/media/product/productsearch/datasheet/rchip/PYu-AC_51_RoHS_L_7.pdf; ComponentLink2Description: DigiKey Link; ComponentLink2URL: https://www.digikey.com/en/products/detail/yageo/AC0402FR-072R2L/5895264; Composition: Thick Film; Device Package: 0402 (1005 Metric); Features: Automotive AEC-Q200, Moisture Resistant; Height - Seated (Max): 0.015" (0.37mm); LastUpdated: 8/31/2025 3:04:17 PM; Lifecycle Status: Active; Minimum Order: 1; Number of Terminations: 2; Operating Temperature: -55°C ~ 155°C; Package / Case: 0402 (1005 Metric); Packaging: CutTape; PartId: 3440; Part Status: Active; Price: 0.01; Ratings: AEC-Q200; Series: AC; Size / Dimension: 0.039" L x 0.020" W (1.00mm x 0.50mm); Supplier 1: DigiKey; Supplier Part Number 1: YAG3471CT-ND; Supplier Device Package: 0402; Tolerance: ±1%
R10 = AC0402FR-0773K2L: RES SMD 73.2K OHM 1% 1/16W 0402; Manufacturer: Yageo; Power (Watts): 0.063W, 1/16W; Resistance: 73.2 kOhms; Temperature Coefficient: ±100ppm/°C; Part Number: AC0402FR-0773K2L; Value: 73.2k; ComponentLink1Description: Datasheet; ComponentLink1URL: https://www.yageo.com/upload/media/product/productsearch/datasheet/rchip/PYu-AC_51_RoHS_L_7.pdf; ComponentLink2Description: DigiKey Link; ComponentLink2URL: https://www.digikey.com/en/products/detail/yageo/AC0402FR-0773K2L/5895501; Composition: Thick Film; Device Package: 0402 (1005 Metric); Features: Automotive AEC-Q200, Moisture Resistant; Height - Seated (Max): 0.015" (0.37mm); LastUpdated: 8/31/2025 3:04:14 PM; Lifecycle Status: Active; Minimum Order: 1; Number of Terminations: 2; Operating Temperature: -55°C ~ 155°C; Package / Case: 0402 (1005 Metric); Packaging: CutTape; PartId: 5215; Part Status: Active; Price: 0.01; Ratings: AEC-Q200; Series: AC; Size / Dimension: 0.039" L x 0.020" W (1.00mm x 0.50mm); Supplier 1: DigiKey; Supplier Part Number 1: YAG5685CT-ND; Supplier Device Package: 0402; Tolerance: ±1%
R11 R12 = AC0402JR-07100KL: RES SMD 100K OHM 5% 1/16W 0402; Manufacturer: Yageo; Power (Watts): 0.063W, 1/16W; Resistance: 100 kOhms; Temperature Coefficient: ±100ppm/°C; Part Number: AC0402JR-07100KL; Value: 100k; ComponentLink1Description: Datasheet; ComponentLink1URL: https://www.yageo.com/upload/media/product/productsearch/datasheet/rchip/PYu-AC_51_RoHS_L_7.pdf; ComponentLink2Description: DigiKey Link; ComponentLink2URL: https://www.digikey.com/en/products/detail/yageo/AC0402JR-07100KL/5895569; Composition: Thick Film; Device Package: 0402 (1005 Metric); Features: Automotive AEC-Q200, Moisture Resistant; Height - Seated (Max): 0.015" (0.37mm); LastUpdated: 8/31/2025 3:04:17 PM; Lifecycle Status: Active; Minimum Order: 1; Number of Terminations: 2; Operating Temperature: -55°C ~ 155°C; Package / Case: 0402 (1005 Metric); Packaging: CutTape; PartId: 3380; Part Status: Active; Price: 0.01; Ratings: AEC-Q200; Series: AC; Size / Dimension: 0.039" L x 0.020" W (1.00mm x 0.50mm); Supplier 1: DigiKey; Supplier Part Number 1: YAG3515CT-ND; Supplier Device Package: 0402; Tolerance: ±5%
R14 = AC0402JR-07200KL: RES SMD 200K OHM 5% 1/16W 0402; Manufacturer: Yageo; Power (Watts): 0.063W, 1/16W; Resistance: 200 kOhms; Temperature Coefficient: ±100ppm/°C; Part Number: AC0402JR-07200KL; Value: 200k; ComponentLink1Description: Datasheet; ComponentLink1URL: https://www.yageo.com/upload/media/product/productsearch/datasheet/rchip/PYu-AC_51_RoHS_L_8.pdf; ComponentLink2Description: DigiKey Link; ComponentLink2URL: https://www.digikey.com/en/products/detail/yageo/AC0402JR-07200KL/5895618; Composition: Thick Film; Device Package: 0402 (1005 Metric); Features: Automotive AEC-Q200, Moisture Resistant; Height - Seated (Max): 0.015" (0.37mm); LastUpdated: 8/31/2025 3:03:52 PM; Lifecycle Status: Active; Minimum Order: 1; Number of Terminations: 2; Operating Temperature: -55°C ~ 155°C; Package / Case: 0402 (1005 Metric); Packaging: CutTape; PartId: 65183; Part Status: Active; Price: 0.01; Ratings: AEC-Q200; Series: AC; Size / Dimension: 0.039" L x 0.020" W (1.00mm x 0.50mm); Supplier 1: DigiKey; Supplier Part Number 1: 13-AC0402JR-07200KLCT-ND; Supplier Device Package: 0402; Tolerance: ±5%
R15 R16 = AC0402JR-075K1L: RES SMD 5.1K OHM 5% 1/16W 0402; Manufacturer: Yageo; Power (Watts): 0.063W, 1/16W; Resistance: 5.1 kOhms; Temperature Coefficient: ±100ppm/°C; Part Number: AC0402JR-075K1L; Value: 5.1k; ComponentLink1Description: Datasheet; ComponentLink1URL: https://www.yageo.com/upload/media/product/productsearch/datasheet/rchip/PYu-AC_51_RoHS_L_7.pdf; ComponentLink2Description: DigiKey Link; ComponentLink2URL: https://www.digikey.com/en/products/detail/yageo/AC0402JR-075K1L/5895695; Composition: Thick Film; Device Package: 0402 (1005 Metric); Features: Automotive AEC-Q200, Moisture Resistant; Height - Seated (Max): 0.015" (0.37mm); LastUpdated: 8/31/2025 3:04:16 PM; Lifecycle Status: Active; Minimum Order: 1; Number of Terminations: 2; Operating Temperature: -55°C ~ 155°C; Package / Case: 0402 (1005 Metric); Packaging: CutTape; PartId: 4690; Part Status: Active; Price: 0.01; Ratings: AEC-Q200; Series: AC; Size / Dimension: 0.039" L x 0.020" W (1.00mm x 0.50mm); Supplier 1: DigiKey; Supplier Part Number 1: YAG3554CT-ND; Supplier Device Package: 0402; Tolerance: ±5%
U1 = CMP-019-00050-1: Switching Regulator
U2 = CMP-019-00059-1: Synchronous Buck Regulator Ultrasonic 28V I/P Adjustable O/P 8A 24-Pin PowerPAK MLP44 T/R; Min Supply Voltage: 3V; Output Voltage: 20V; Max Power Dissipation: 7.75W; Max Operating Temperature: 105°C; Max Supply Voltage: 28V; Min Operating Temperature: -40°C; Output Current: 8A

## Nets that join several sheets
+3V3: μC-Core (22 pins), Headers-SolderPads (H1.1 P6.1 P12.1 SB2.1), Sensors (10 pins), Pyro-Other (6 pins), Power-scheme (C5.2 C6.2 L1.2 R7.2)
+3V3_IMU: Sensors (C30.2 C34.2 IC4.5 IC4.8), Power-scheme (C8.2 C21.2 IC1.5)
+5V: Headers-SolderPads (6 pins), Sensors (7 pins), Pyro-Other (C42.1 D8.1 LS1.1 U4.3), Power-scheme (9 pins)
+5VBUCK: Headers-SolderPads (7 pins), Power-scheme (6 pins)
+VBATT: Headers-SolderPads (6 pins), Sensors (R19.2), Pyro-Other (F1.1 F2.1 F3.1), Power-scheme (11 pins)
GND: μC-Core (23 pins), Headers-SolderPads (32 pins), Sensors (29 pins), Pyro-Other (23 pins), Power-scheme (34 pins)
AUX_MISO: μC-Core (U3.17), Sensors (IC3.11), Pyro-Other (IC7.2)
AUX_MOSI: μC-Core (U3.16), Sensors (IC3.9), Pyro-Other (IC7.5)
AUX_SCK: μC-Core (U3.68), Sensors (IC3.10), Pyro-Other (IC7.6)
BUZZER: μC-Core (U3.3), Pyro-Other (R47.1)
CAM_IN: Headers-SolderPads (J13.3), Sensors (C38.1 R29.2)
CAN_N: Headers-SolderPads (P9.1), Pyro-Other (R46.1 U4.6)
CAN_P: Headers-SolderPads (P3.1), Pyro-Other (R46.2 U4.7)
ESC_CURR: μC-Core (U3.35), Headers-SolderPads (J5.3 J6.3)
ESC_TELEM: μC-Core (U3.81), Headers-SolderPads (J5.4 J6.4)
FC_VOLTAGE: μC-Core (U3.15), Sensors (R19.1 R21.2)
FLASH_CS: μC-Core (U3.18), Pyro-Other (IC7.1)
I2C_SCL: μC-Core (R2.1 U3.92), Headers-SolderPads (J17.6), Sensors (IC2.2)
I2C_SDA: μC-Core (R3.1 U3.93), Headers-SolderPads (J17.5), Sensors (IC2.4)
IMU_CS: μC-Core (U3.28), Sensors (IC4.12)
IMU_INT1: μC-Core (U3.4), Sensors (IC4.4)
IMU_MISO: μC-Core (U3.30), Sensors (IC4.1)
IMU_MOSI: μC-Core (U3.31), Sensors (IC4.14)
IMU_SCK: μC-Core (U3.29), Sensors (IC4.13)
M1: μC-Core (U3.22), Headers-SolderPads (J5.5 J6.5)
M2: μC-Core (U3.23), Headers-SolderPads (J5.6)
M3: μC-Core (U3.24), Headers-SolderPads (J5.7)
M4: μC-Core (U3.25), Headers-SolderPads (J5.8)
NetU3_1: μC-Core (U3.1), Pyro-Other (U4.8)
NetU3_95: μC-Core (U3.95), Pyro-Other (U4.4)
NetU3_96: μC-Core (U3.96), Pyro-Other (U4.1)
NRST: μC-Core (C31.2 R1.2 S2.1 U3.14), Headers-SolderPads (H1.2)
OSD_CS: μC-Core (U3.90), Sensors (IC3.8)
PYRO_CH1: μC-Core (U3.59), Pyro-Other (R31.1 R37.2)
PYRO_CH1_CONT: μC-Core (U3.32), Pyro-Other (R34.1 R41.2)
PYRO_CH2: μC-Core (U3.60), Pyro-Other (R32.1 R38.2)
PYRO_CH2_CONT: μC-Core (U3.33), Pyro-Other (R35.1 R43.2)
PYRO_CH3: μC-Core (U3.61), Pyro-Other (R33.1 R39.2)
PYRO_CH3_CONT: μC-Core (U3.34), Pyro-Other (R36.1 R45.2)
SDIO_CLK: μC-Core (U3.80), Sensors (R51.2)
SDIO_CMD: μC-Core (U3.83), Sensors (R52.2)
SDIO_D0: μC-Core (U3.65), Sensors (R22.2)
SDIO_D1: μC-Core (U3.66), Sensors (R25.2)
SDIO_D2: μC-Core (U3.78), Sensors (R26.2)
SDIO_D3: μC-Core (U3.79), Sensors (R50.2)
SWCLK: μC-Core (U3.76), Headers-SolderPads (H1.5)
SWDIO: μC-Core (U3.72), Headers-SolderPads (H1.6)
SWO: μC-Core (U3.89), Headers-SolderPads (H1.4)
TIM1_CH1: μC-Core (U3.39), Headers-SolderPads (J7.3)
TIM1_CH2: μC-Core (U3.41), Headers-SolderPads (J8.3)
TIM1_CH3: μC-Core (U3.43), Headers-SolderPads (J9.3)
TIM1_CH4: μC-Core (U3.44), Headers-SolderPads (J10.3)
TIM2_CH3: μC-Core (U3.46), Headers-SolderPads (J11.3)
TIM2_CH4: μC-Core (U3.47), Headers-SolderPads (J12.3)
UART1_RX: μC-Core (U3.54), Headers-SolderPads (J14.4)
UART1_TX: μC-Core (U3.53), Headers-SolderPads (J14.3)
UART2_RX: μC-Core (U3.87), Headers-SolderPads (P17.3)
UART2_TX: μC-Core (U3.86), Headers-SolderPads (P17.4)
UART3_RX: μC-Core (U3.56), Headers-SolderPads (J17.4)
UART3_TX: μC-Core (U3.55), Headers-SolderPads (J17.3)
UART5_RX: μC-Core (U3.51), Headers-SolderPads (J13.5)
UART5_TX: μC-Core (U3.52), Headers-SolderPads (J13.4)
UART6_RX: μC-Core (U3.64), Headers-SolderPads (J15.4)
UART6_TX: μC-Core (U3.63), Headers-SolderPads (J15.3)
UART7_RX: μC-Core (U3.37), Headers-SolderPads (P8.1)
UART7_TX: μC-Core (U3.38), Headers-SolderPads (P2.1)
UART8_RX: μC-Core (U3.97), Headers-SolderPads (P16.1)
UART8_TX: μC-Core (U3.98), Headers-SolderPads (P14.1)
USB_D_N: μC-Core (U3.70), Power-scheme (D2.1 J3.A7 J3.B7)
USB_D_P: μC-Core (U3.71), Power-scheme (D2.2 J3.A6 J3.B6)
VIDEO_OUT: Headers-SolderPads (P17.6), Sensors (R23.2)